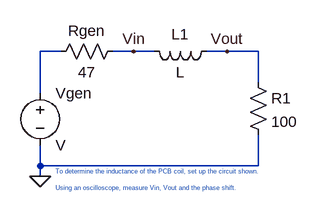
[diagram p0: schematic Simulation.asc]
Simulation.asc, the LTspice schematic file:
Version 4
SHEET 1 880 680
WIRE 96 64 64 64
WIRE 208 64 176 64
WIRE 240 64 208 64
WIRE 352 64 320 64
WIRE 400 64 352 64
WIRE 400 112 400 64
WIRE 64 128 64 64
WIRE 64 240 64 208
WIRE 400 240 400 192
WIRE 400 240 64 240
WIRE 64 256 64 240
FLAG 64 256 0
FLAG 208 64 Vin
FLAG 352 64 Vout
SYMBOL res 384 96 R0
SYMATTR InstName R1
SYMATTR Value 100
SYMBOL ind 336 48 R90
WINDOW 0 5 56 VBottom 2
WINDOW 3 32 56 VTop 2
SYMATTR InstName L1
SYMBOL voltage 64 112 R0
SYMATTR InstName Vgen
SYMBOL res 192 48 R90
WINDOW 0 0 56 VBottom 2
WINDOW 3 32 56 VTop 2
SYMATTR InstName Rgen
SYMATTR Value 47
TEXT 88 248 Left 0 ;To determine the inductance of the PCB coil, set up the circuit shown.\n \nUsing an oscilloscope, measure Vin, Vout and the phase shift.

The netlist it stands for:
* Simulation.asc
R1 Vout 0 100
L1 Vout Vin L
Vgen N001 0 V
Rgen Vin N001 47
* To determine the inductance of the PCB coil, set up the circuit shown.
* Using an oscilloscope, measure Vin, Vout and the phase shift.
.backanno
.end